# Altium project AirConditionAssistant.PrjPcb
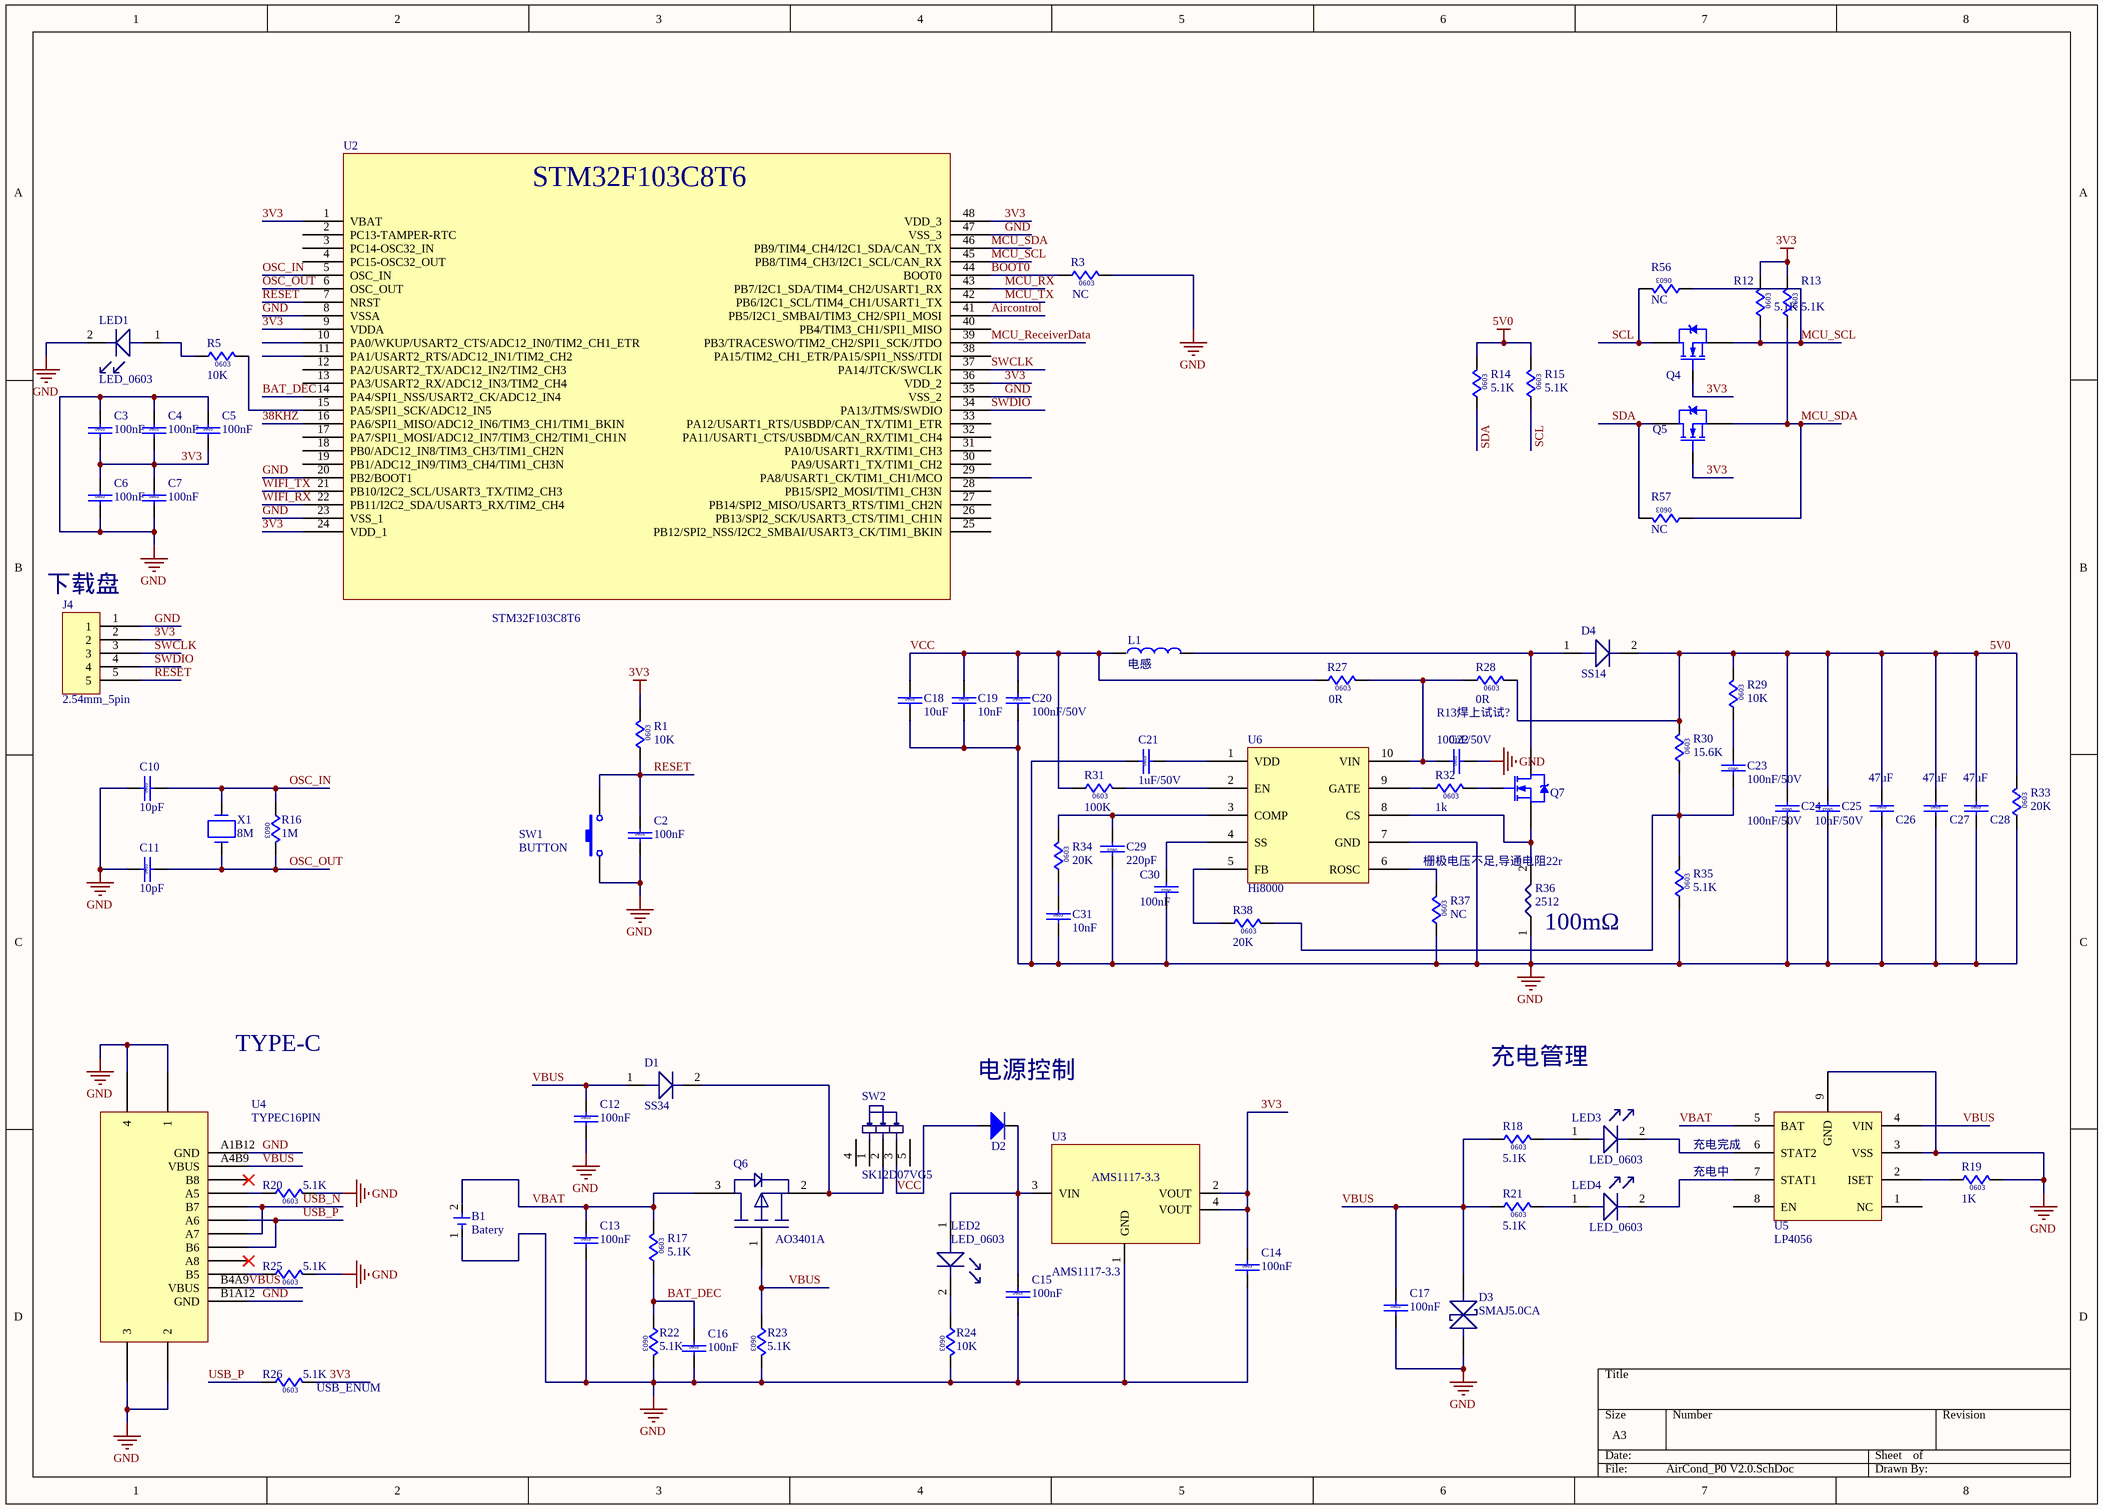
[diagram p0: AirCond_P0 V2.0.SchDoc]
2 sheets, 125 parts. Net scope: global (net labels, ports and power ports of the same name join across sheets).
Board file: AirController V2.0.PcbDoc
Sheets:
  AirCond_P0 V2.0.SchDoc
  AirCond_P1 V2.0.SchDoc

## Sheet AirCond_P0 V2.0.SchDoc
size A3

### Parts
B1  Batery  [BateryBox]
C2  100nF  [0603/CAP]
C3  100nF  [0603/CAP]
C4  100nF  [0603/CAP]
C5  100nF  [0603/CAP]
C6  100nF  [0603/CAP]
C7  100nF  [0603/CAP]
C10  10pF  [0603/CAP]
C11  10pF  [0603/CAP]
C12  100nF  [0603/CAP]
C13  100nF  [0603/CAP]
C14  100nF  [0603/CAP]
C15  100nF  [0603/CAP]
C16  100nF  [0603/CAP]
C17  100nF  [0603/CAP]
C18  10uF  [0603/CAP]
C19  10nF  [0603/CAP]
C20  100nF/50V  [0603/CAP]
C21  1uF/50V  [0603/CAP]
C22  100nF/50V  [0603/CAP]
C23  100nF/50V  [0603/CAP]
C24  100nF/50V  [0603/CAP]
C25  10nF/50V  [0603/CAP]
C26  47uF  [0805 - CAP]
C27  47uF  [0805 - CAP]
C28  47uF  [0805 - CAP]
C29  220pF  [0603/CAP]
C30  100nF  [0603/CAP]
C31  10nF  [0603/CAP]
D1  SS34  [SMA_L4.3-W2.6-LS5.0-RD]
D2  S1MFL  [SOD-123Fl]  (value not drawn)
D3  SMAJ5.0CA  [DO-214AC(SMA)]
D4  SS14  [SMA_L4.3-W2.6-LS5.0-RD]
J4  2.54mm_5pin  [2.54mm_5P]
L1  电感  [SRP7028A-4R7]
LED1  LED_0603  [0603/RES]
LED2  LED_0603  [0603/RES]
LED3  LED_0603  [0603/RES]
LED4  LED_0603  [0603/RES]
Q4  NMOS  [SOT-23]  (value not drawn)
Q5  NMOS  [SOT-23]  (value not drawn)
Q6  AO3401A  [SOT-23]
Q7  NMOS  [SOT-23]  (value not drawn)
R1  10K  [0603/RES]
R3  NC  [0603/RES]
R5  10K  [0603/RES]
R12  5.1K  [0603/RES]
R13  5.1K  [0603/RES]
R14  5.1K  [0603/RES]
R15  5.1K  [0603/RES]
R16  1M  [0603/RES]
R17  5.1K  [0603/RES]
R18  5.1K  [0603/RES]
R19  1K  [0603/RES]
R20  5.1K  [0603/RES]
R21  5.1K  [0603/RES]
R22  5.1K  [0603/RES]
R23  5.1K  [0603/RES]
R24  10K  [0603/RES]
R25  5.1K  [0603/RES]
R26  5.1K  [0603/RES]
R27  0R  [0603/RES]
R28  0R  [0603/RES]
R29  10K  [0603/RES]
R30  15.6K  [0603/RES]
R31  100K  [0603/RES]
R32  1k  [0603/RES]
R33  20K  [0603/RES]
R34  20K  [0603/RES]
R35  5.1K  [0603/RES]
R36  2512  [2512]
R37  NC  [0603/RES]
R38  20K  [0603/RES]
R56  NC  [0603/RES]
R57  NC  [0603/RES]
SW1  BUTTON  [Key-D8mm]
SW2  SK12D07VG5  [SK12D07VG5]
U2  STM32F103C8T6  [LQFP48-STM32]
U3  AMS1117-3.3  [AMS1117-3.3]
U4  TYPEC16PIN  [Type-C 16PIN]
U5  LP4056  [ESOP-8]
U6  Hi8000  [ESSOP10]
X1  8M  [两脚晶振]

### Nets
3V3: C3.2 C4.2 C5.2 C6.1 C7.1 C14.1 J4.2 Q4.1(G) Q5.1(G) R1.2 R12.2 R13.2 R26.2 U2.1(VBAT) U2.9(VDDA) U2.24(VDD_1) U2.36(VDD_2) U2.48(VDD_3) U3.2(VOUT) U3.4(VOUT)
5V0: C24.2 C25.2 C26.1 C27.1 C28.1 D4.2 R14.2 R15.2 R28.2 R29.2 R30.2 R33.2
GND: B1.1(-) C2.2 C3.1 C4.1 C5.1 C6.2 C7.2 C10.1 C11.1 C12.2 C13.2 C14.2 C15.2 C16.2 C17.2 C18.2 C19.2 C20.2 C21.1 C22.2 C24.1 C25.1 C26.2 C27.2 C28.2 C29.1 C30.1 C31.2 D3.2 J4.1 LED1.2 R3.2 R19.2 R20.2 R22.2 R23.2 R24.2 R25.2 R33.1 R35.1 R36.1 R37.1 SW1.1 U2.8(VSSA) U2.20(PB2/BOOT1) U2.23(VSS_1) U2.35(VSS_2) U2.47(VSS_3) U3.1(GND) U4.1 U4.2 U4.3 U4.4 U4.A1B12(GND) U4.B1A12(GND) U5.3(VSS) U5.9(GND) U6.7(GND)
38KHZ: U2.16(PA6/SPI1_MISO/ADC12_IN6/TIM3_CH1/TIM1_BKIN)
Aircontrol: U2.41(PB5/I2C1_SMBAI/TIM3_CH2/SPI1_MOSI)
BAT_DEC: C16.1 R17.1 R22.1 U2.14(PA4/SPI1_NSS/USART2_CK/ADC12_IN4)
BOOT0: R3.1 U2.44(BOOT0)
MCU_ReceiverData: U2.39(PB3/TRACESWO/TIM2_CH2/SPI1_SCK/JTDO)
MCU_RX: U2.43(PB7/I2C1_SDA/TIM4_CH2/USART1_RX)
MCU_SCL: Q4.2(S) R12.1 R56.1 U2.45(PB8/TIM4_CH3/I2C1_SCL/CAN_RX)
MCU_SDA: Q5.2(S) R13.1 R57.1 U2.46(PB9/TIM4_CH4/I2C1_SDA/CAN_TX)
MCU_TX: U2.42(PB6/I2C1_SCL/TIM4_CH1/USART1_TX)
OSC_IN: C10.2 R16.1 U2.5(OSC_IN) X1.2
OSC_OUT: C11.2 R16.2 U2.6(OSC_OUT) X1.1
RESET: C2.1 J4.5 R1.1 SW1.2 U2.7(NRST)
SCL: Q4.3(D) R15.1 R56.2
SDA: Q5.3(D) R14.1 R57.2
SWCLK: J4.3 U2.37(PA14/JTCK/SWCLK)
SWDIO: J4.4 U2.34(PA13/JTMS/SWDIO)
USB_N: U4.A7 U4.B7
USB_P: R26.1 U4.A6 U4.B6
VBAT: B1.2(+) C13.1 Q6.3 R17.2 U5.5(BAT)
VBUS: C12.1 C17.1 D1.1 D3.1 Q6.1 R18.1 R21.1 R23.1 U4.A4B9(VBUS) U4.B4A9(VBUS) U5.4(VIN)
VCC: C18.1 C19.1 C20.1 D2.1 L1.1 R27.1 R31.1 SW2.3
WIFI_RX: U2.22(PB11/I2C2_SDA/USART3_RX/TIM2_CH4)
WIFI_TX: U2.21(PB10/I2C2_SCL/USART3_TX/TIM2_CH3)
NetC15_1: C15.1 D2.2 LED2.1 U3.3(VIN)
NetC21_2: C21.2 U6.1(VDD)
NetC22_1: C22.1 R27.2 R28.1 U6.10(VIN)
NetC23_1: C23.1 R30.1 R35.2 R38.2
NetC23_2: C23.2 R29.1
NetC29_2: C29.2 R34.2 U6.3(COMP)
NetC30_2: C30.2 U6.4(SS)
NetC31_1: C31.1 R34.1
NetD1_2: D1.2 Q6.2 SW2.2
NetD4_1: D4.1 L1.2 Q7.3(D)
NetLED1_1: LED1.1 R5.1
NetLED2_2: LED2.2 R24.1
NetLED3_1: LED3.1 R18.2
NetLED3_2: LED3.2 U5.6(STAT2)
NetLED4_1: LED4.1 R21.2
NetLED4_2: LED4.2 U5.7(STAT1)
NetQ7_1: Q7.1(G) R32.2
NetQ7_2: Q7.2(S) R36.2 U6.8(CS)
NetR5_2: R5.2 U2.15(PA5/SPI1_SCK/ADC12_IN5)
NetR19_1: R19.1 U5.2(ISET)
NetR20_1: R20.1 U4.A5
NetR25_1: R25.1 U4.B5
NetR31_2: R31.2 U6.2(EN)
NetR32_1: R32.1 U6.9(GATE)
NetR37_2: R37.2 U6.6(ROSC)
NetR38_1: R38.1 U6.5(FB)

Not connected (* = marked no-connect by the designer): SW2 1 4 5; U2 2(PC13-TAMPER-RTC) 3(PC14-OSC32_IN) 4(PC15-OSC32_OUT) 10(PA0/WKUP/USART2_CTS/ADC12_IN0/TIM2_CH1_ETR) 11(PA1/USART2_RTS/ADC12_IN1/TIM2_CH2) 12(PA2/USART2_TX/ADC12_IN2/TIM2_CH3) 13(PA3/USART2_RX/ADC12_IN3/TIM2_CH4) 17(PA7/SPI1_MOSI/ADC12_IN7/TIM3_CH2/TIM1_CH1N) 18(PB0/ADC12_IN8/TIM3_CH3/TIM1_CH2N) 19(PB1/ADC12_IN9/TIM3_CH4/TIM1_CH3N) 25(PB12/SPI2_NSS/I2C2_SMBAI/USART3_CK/TIM1_BKIN) 26(PB13/SPI2_SCK/USART3_CTS/TIM1_CH1N) 27(PB14/SPI2_MISO/USART3_RTS/TIM1_CH2N) 28(PB15/SPI2_MOSI/TIM1_CH3N) 29(PA8/USART1_CK/TIM1_CH1/MCO) 30(PA9/USART1_TX/TIM1_CH2) 31(PA10/USART1_RX/TIM1_CH3) 32(PA11/USART1_CTS/USBDM/CAN_RX/TIM1_CH4) 33(PA12/USART1_RTS/USBDP/CAN_TX/TIM1_ETR) 38(PA15/TIM2_CH1_ETR/PA15/SPI1_NSS/JTDI) 40(PB4/TIM3_CH1/SPI1_MISO); U4 A8* B8*; U5 1(NC) 8(EN)

### Notes on the sheet
- (near J4) 下载盘
- R13焊上试试?
- 栅极电压不足,导通电阻22r
- (near R36) 100mΩ
- TYPE-C
- (near D2) 电源控制
- 充电管理
- 充电完成
- 充电中
- (near R26) USB_ENUM
- (in symbol CAP/0603) 0603
- (in symbol CAP/0805) 0805
- (in symbol RES/0603) 0603

### Library data of the parts
C2-C7 C10-C25 C29-C31 = CAP/0603
C26-C28 = CAP/0805
D4 = SS34
Q4 Q5 Q7 = N-MOSE: TSM340N06P: TSM340N06P
R1 R3 R5 R12-R35 R37 R38 R56 R57 = RES/0603
SW1 = BUTTON_1
U2 = STM32F103C8T6: STM32F103
X1 = 两脚 晶振

## Sheet AirCond_P1 V2.0.SchDoc
size A4
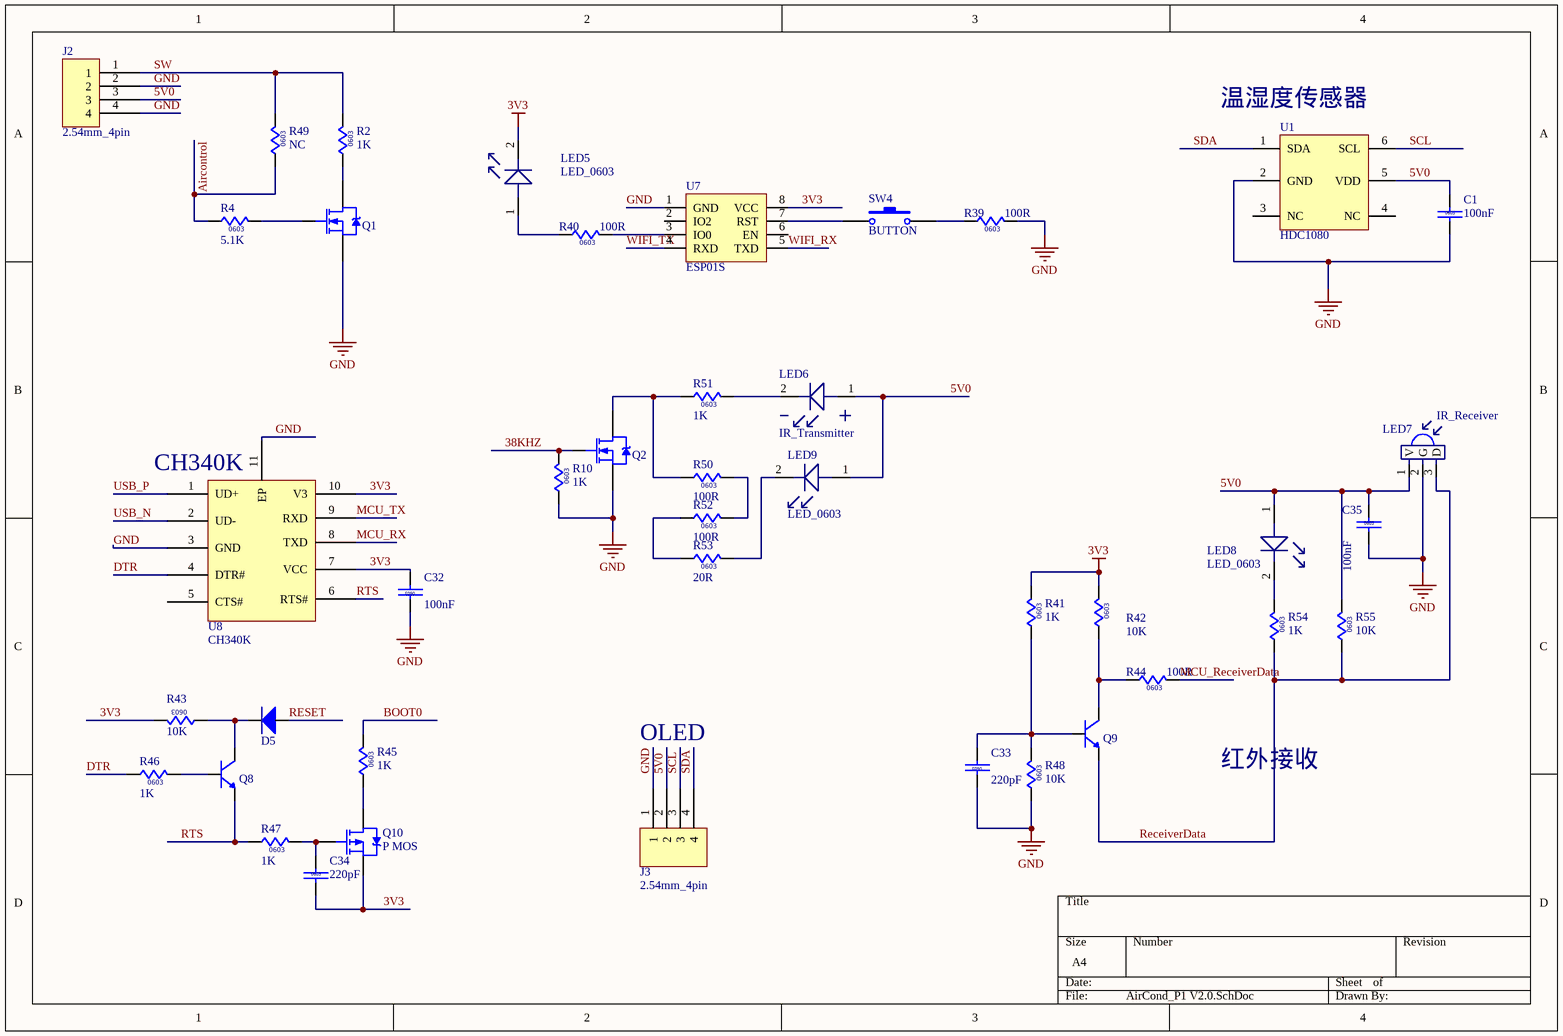
[diagram p1: AirCond_P1 V2.0.SchDoc]

### Parts
C1  100nF  [0603/CAP]
C32  100nF  [0603/CAP]
C33  220pF  [0603/CAP]
C34  220pF  [0603/CAP]
C35  100nF  [0603/CAP]
D5  S1M  [DO-214AC(SMA)]  (value not drawn)
J2  2.54mm_4pin  [2.54mm_4pin]
J3  2.54mm_4pin  [2.54mm_4pin]
LED5  LED_0603  [0603/RES]
LED6  IR_Transmitter  [2.54_2pin]
LED7  IR_Receiver  [2.54mm_3pin]
LED8  LED_0603  [0603/RES]
LED9  LED_0603  [0603/RES]
Q1  NMOS  [SOT-23]  (value not drawn)
Q2  NMOS  [SOT-23]  (value not drawn)
Q8  BC817-16  [SOT-23]  (value not drawn)
Q9  BC817-16  [SOT-23]  (value not drawn)
Q10  P MOS  [SOT-23]
R2  1K  [0603/RES]
R4  5.1K  [0603/RES]
R10  1K  [0603/RES]
R39  100R  [0603/RES]
R40  100R  [0603/RES]
R41  1K  [0603/RES]
R42  10K  [0603/RES]
R43  10K  [0603/RES]
R44  100R  [0603/RES]
R45  1K  [0603/RES]
R46  1K  [0603/RES]
R47  1K  [0603/RES]
R48  10K  [0603/RES]
R49  NC  [0603/RES]
R50  100R  [0603/RES]
R51  1K  [0603/RES]
R52  100R  [0603/RES]
R53  20R  [0603/RES]
R54  1K  [0603/RES]
R55  10K  [0603/RES]
SW4  BUTTON  [Key-D8mm]
U1  HDC1080  [HDC1080]
U7  ESP01S  [2.54MM_2X4PIN]
U8  CH340K  [ESSOP10]

### Nets
3V3: C32.2 C34.2 LED5.2 Q10.2(S) R41.2 R42.2 R43.2 U7.8(VCC) U8.7(VCC) U8.10(V3)
5V0: C1.1 C35.1 J2.3 J3.2 LED6.1 LED7.1(V) LED8.1 LED9.1 R55.2 U1.5(VDD)
GND: C1.2 C32.1 C33.1 C35.2 J2.2 J2.4 J3.1 LED7.2(G) Q1.2(S) Q2.2(S) R10.1 R39.2 R48.1 U1.2(GND) U7.1(GND) U8.3(GND) U8.11(EP)
38KHZ: Q2.1(G) R10.2
Aircontrol: R4.1 R49.1
BOOT0: R45.2
DTR: R46.1 U8.4(DTR#)
MCU_ReceiverData: R44.2
MCU_RX: U8.8(TXD)
MCU_TX: U8.9(RXD)
ReceiverData: LED7.3(D) Q9.2(E) R54.1 R55.1
RESET: D5.1
RTS: Q8.2(E) R47.1 U8.6(RTS#)
SCL: J3.3 U1.6(SCL)
SDA: J3.4 U1.1(SDA)
SW: J2.1 R2.2 R49.2
USB_N: U8.2(UD-)
USB_P: U8.1(UD+)
WIFI_RX: U7.5(TXD)
WIFI_TX: U7.4(RXD)
NetC33_2: C33.2 Q9.1(B) R41.1 R48.2
NetC34_1: C34.1 Q10.1(G) R47.2
NetD5_2: D5.2 Q8.3(C) R43.1
NetLED5_1: LED5.1 R40.1
NetLED6_2: LED6.2 R51.2
NetLED8_2: LED8.2 R54.2
NetLED9_2: LED9.2 R53.2
NetQ1_1: Q1.1(G) R4.2
NetQ1_3: Q1.3(D) R2.1
NetQ2_3: Q2.3(D) R50.1 R51.1
NetQ8_1: Q8.1(B) R46.2
NetQ9_3: Q9.3(C) R42.1 R44.1
NetQ10_3: Q10.3(D) R45.1
NetR39_1: R39.1 SW4.2
NetR40_2: R40.2 U7.3(IO0)
NetR50_2: R50.2 R52.2
NetR52_1: R52.1 R53.1
NetSW4_1: SW4.1 U7.7(RST)

Not connected (* = marked no-connect by the designer): U1 3(NC) 4(NC); U7 2(IO2) 6(EN); U8 5(CTS#)

### Notes on the sheet
- (near U1) 温湿度传感器
- (near U8) CH340K
- OLED
- 红外接收
- (in symbol CAP/0603) 0603
- (in symbol RES/0603) 0603

### Library data of the parts
C1 C32-C35 = CAP/0603
D5 = S1M: S1M: DO-214AC; S2MAH: DO-214AC
Q1 Q2 = N-MOSE: TSM340N06P: TSM340N06P
Q8 Q9 = NPN
Q10 = PMOS-3: P-Channel Power MOSFET; Note: Pin 4 not drawn and electrically connected to Pin 2.; Published: 8-Jun-2000; LatestRevisionDate: 17-Jul-2002; LatestRevisionNote: Re-released for DXP Platform.; DatasheetVersion: PD-9.390D; PackageVersion: Feb-1997; PackageReference: TO-220AB; Publisher: Altium Limited; PackageDescription: TO, Thru-Hole, Vertical, Heatsink Mounted; 3 In-Line Leads; Pitch 2.54 mm; ComponentLink1Description: Manufacturer Link; ComponentLink1URL: http://www.irf.com/
R2 R4 R10 R39-R55 = RES/0603
SW4 = BUTTON_1

## Nets that join several sheets
3V3: AirCond_P0 V2.0 (20 pins), AirCond_P1 V2.0 (10 pins)
5V0: AirCond_P0 V2.0 (12 pins), AirCond_P1 V2.0 (10 pins)
GND: AirCond_P0 V2.0 (58 pins), AirCond_P1 V2.0 (17 pins)
38KHZ: AirCond_P0 V2.0 (U2.16), AirCond_P1 V2.0 (Q2.1 R10.2)
Aircontrol: AirCond_P0 V2.0 (U2.41), AirCond_P1 V2.0 (R4.1 R49.1)
BOOT0: AirCond_P0 V2.0 (R3.1 U2.44), AirCond_P1 V2.0 (R45.2)
MCU_ReceiverData: AirCond_P0 V2.0 (U2.39), AirCond_P1 V2.0 (R44.2)
MCU_RX: AirCond_P0 V2.0 (U2.43), AirCond_P1 V2.0 (U8.8)
MCU_TX: AirCond_P0 V2.0 (U2.42), AirCond_P1 V2.0 (U8.9)
RESET: AirCond_P0 V2.0 (5 pins), AirCond_P1 V2.0 (D5.1)
SCL: AirCond_P0 V2.0 (Q4.3 R15.1 R56.2), AirCond_P1 V2.0 (J3.3 U1.6)
SDA: AirCond_P0 V2.0 (Q5.3 R14.1 R57.2), AirCond_P1 V2.0 (J3.4 U1.1)
USB_N: AirCond_P0 V2.0 (U4.A7 U4.B7), AirCond_P1 V2.0 (U8.2)
USB_P: AirCond_P0 V2.0 (R26.1 U4.A6 U4.B6), AirCond_P1 V2.0 (U8.1)
WIFI_RX: AirCond_P0 V2.0 (U2.22), AirCond_P1 V2.0 (U7.5)
WIFI_TX: AirCond_P0 V2.0 (U2.21), AirCond_P1 V2.0 (U7.4)